# Altium schematic sheet Power supply.SchDoc
size A4; DocumentNumber: 5; SheetNumber: 4; SheetTotal: 5
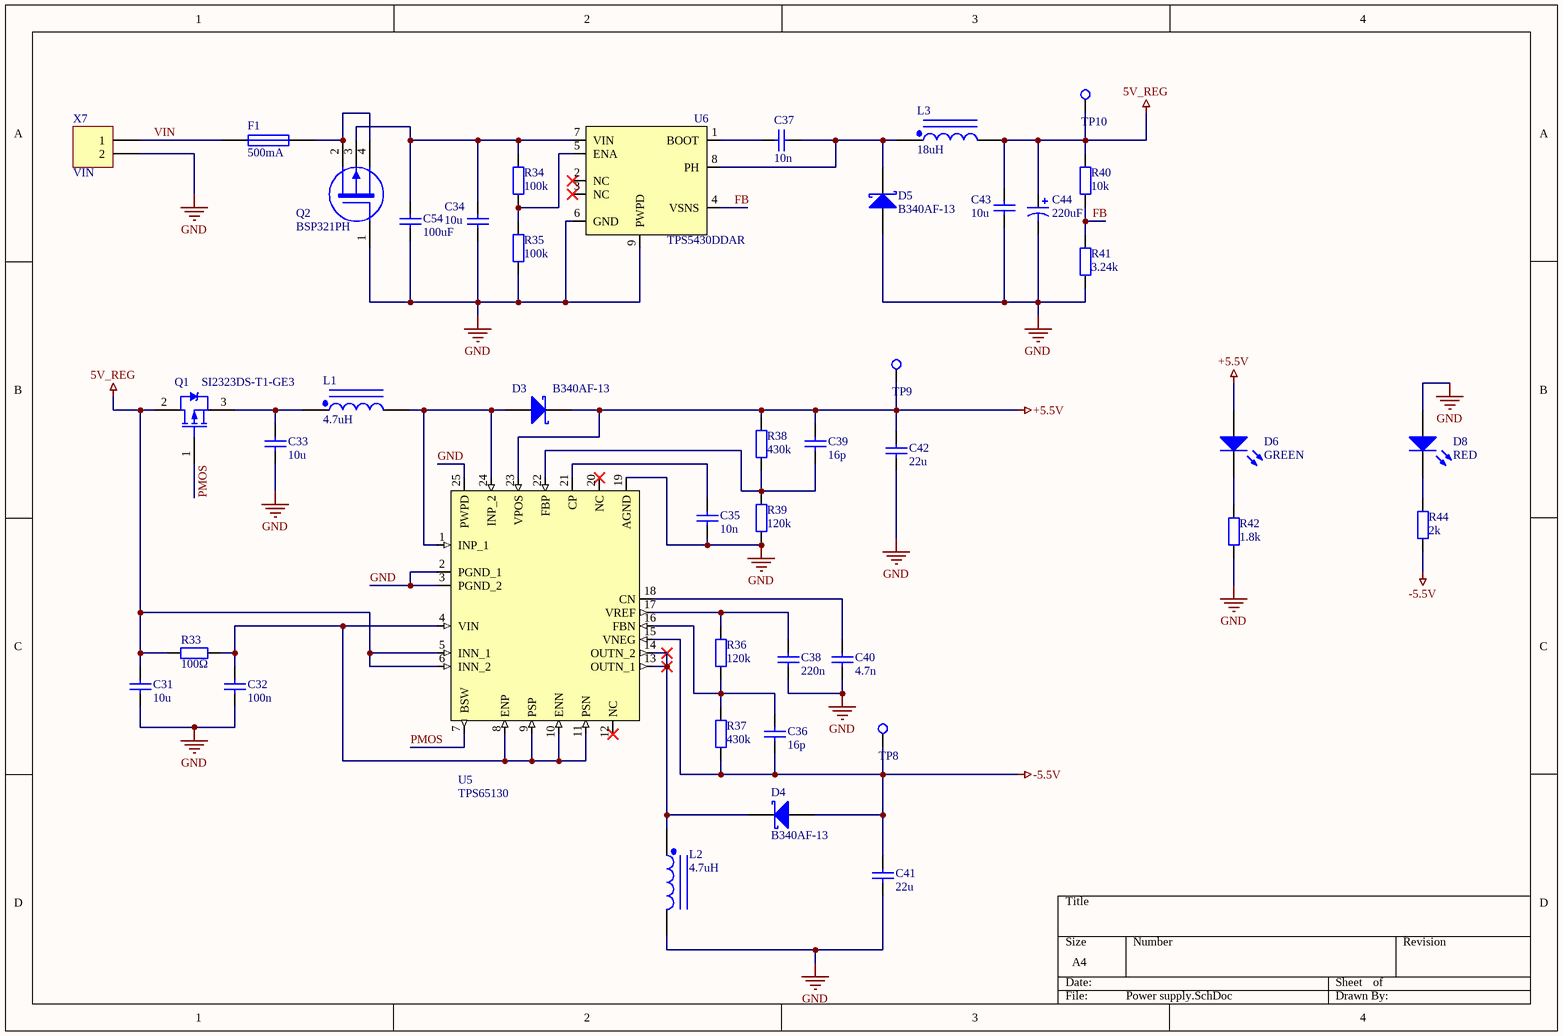
[diagram p0: Power supply.SchDoc]

## Parts
C31  10u  [CAPC2012X110N]
C32  100n  [CAPC1608X87N]
C33  10u  [CAPC2012X110N]
C34  10u  [CAPC2012X110N]
C35  10n  [CAPC1608X87N]
C36  16p  [CAPC1608X87N]
C37  10n  [CAPC1608X87N]
C38  220n  [CAPC1608X87N]
C39  16p  [CAPC1608X87N]
C40  4.7n  [CAPC1608X87N]
C41  22u  [CAPC3225X270N]
C42  22u  [CAPC3225X270N]
C43  10u  [CAPC2012X110N]
C44  220uF  [CAPPM7344X310N]
C54  100uF  [CAPAE1000X1050N]
D3  B340AF-13  [SODFL5226X110N]
D4  B340AF-13  [SODFL5226X110N]
D5  B340AF-13  [SODFL5226X110N]
D6  GREEN  [LEDC2012X110N]
D8  RED  [LEDC2012X110N]
F1  500mA  [RESC1608X55N]
L1  4.7uH  [B82462G4472M]
L2  4.7uH  [B82462G4472M]
L3  18uH  [SRR4828A180M]
Q1  SI2323DS-T1-GE3  [SOT95P237X112-3N]
Q2  BSP321PH  [SOT230P700X170-4N]
R33  100Ω  [RESC1608X55N]
R34  100k  [RESC1608X55N]
R35  100k  [RESC1608X55N]
R36  120k  [RESC1608X55N]
R37  430k  [RESC1608X55N]
R38  430k  [RESC1608X55N]
R39  120k  [RESC1608X55N]
R40  10k  [RESC1608X55N]
R41  3.24k  [RESC1608X55N]
R42  1.8k  [RESC1608X55N]
R44  2k  [RESC1608X55N]
TP8  TP  [TEST-POINT]  (value not drawn)  (no BOM)
TP9  TP  [TEST-POINT]  (value not drawn)  (no BOM)
TP10  TP  [TEST-POINT]  (value not drawn)  (no BOM)
U5  TPS65130  [QFN50P400X400X100-25N-D]
U6  TPS5430DDAR  [SOIC127P600X170-9N]
X7  VIN  [SHDR2W100P0X500_1X2_1120X800X1100P]

## Nets
5V_REG: C31.2 C43.2 C44.1 L3.2 Q1.2(D) R33.1 R40.2 TP10.0 U5.5(INN_1) U5.6(INN_2)
+5.5V: C39.2 C42.2 D3.2(K) D6.1(A) R38.2 TP9.0 U5.23(VPOS)
-5.5V: C36.1 C41.2 D4.1(A) R37.1 R44.1 TP8.0 U5.15(VNEG)
GND: C31.1 C32.1 C33.1 C34.1 C35.1 C38.1 C40.1 C41.1 C42.1 C43.1 C44.2 C54.1 D5.1(A) D8.1(A) L2.2 Q2.1(G) R35.1 R39.1 R41.1 R42.2 U5.2(PGND_1) U5.3(PGND_2) U5.19(AGND) U5.25(PWPD) U6.6(GND) U6.9(PWPD) X7.2
FB: R40.1 R41.2 U6.4(VSNS)
PMOS: Q1.1(G) U5.7(BSW)
VIN: F1.2 X7.1
NetC32_2: C32.2 R33.2 U5.4(VIN) U5.8(ENP) U5.9(PSP) U5.10(ENN) U5.11(PSN)
NetC33_2: C33.2 L1.1 Q1.3(S)
NetC34_2: C34.2 C54.2 Q2.3(U) R34.2 U6.7(VIN)
NetC35_2: C35.2 U5.21(CP)
NetC36_2: C36.2 R36.1 R37.2 U5.16(FBN)
NetC37_1: C37.1 U6.1(BOOT)
NetC37_2: C37.2 D5.2(K) L3.1 U6.8(PH)
NetC38_2: C38.2 R36.2 U5.17(VREF)
NetC39_1: C39.1 R38.1 R39.2 U5.22(FBP)
NetC40_2: C40.2 U5.18(CN)
NetD3_1: D3.1(A) L1.2 U5.1(INP_1) U5.24(INP_2)
NetD4_2: D4.2(K) L2.1 U5.13(OUTN_1) U5.14(OUTN_2)
NetD6_2: D6.2(K) R42.1
NetD8_2: D8.2(K) R44.2
NetF1_1: F1.1 Q2.2(D) Q2.4(S)
NetR34_1: R34.1 R35.2 U6.5(ENA)

Not connected (* = marked no-connect by the designer): U5 12(NC)* 20(NC)*; U6 2(NC)* 3(NC)*

## Library data of the parts
C31 C33 C34 C43 = Cap: Manufacturer 1: Taiyo Yuden; Manufacturer Part Number 1: EMK212BB7106KG-T
C32 = Cap
C35 C37 = Cap: Manufacturer 1: KEMET; Manufacturer Part Number 1: C0603C103J4RACAUTO
C36 C39 = Cap: Manufacturer 1: Taiyo Yuden; Manufacturer Part Number 1: AC0603JRNPO9BN160
C38 = Cap: Manufacturer 1: KEMET; Manufacturer Part Number 1: C0603C224J4RECTU
C40 = Cap: Manufacturer 1: KEMET; Manufacturer Part Number 1: C0603C472J5RACTU
C41 C42 = Cap: Manufacturer 1: Taiyo Yuden; Manufacturer Part Number 1: TMK325B7226MMHP
C44 = Cap Pol1: Manufacturer 1: AVX; Manufacturer Part Number 1: TPSD227M016R0200V
C54 = Cap: Capacitor; Manufacturer 1: Panasonic; Manufacturer Part Number 1: EEE-FC1V101P
D3-D5 = D Schottky: Manufacturer 1: Diodes Incorporated; Manufacturer Part Number 1: B340AF-13
D6 = LED1: Manufacturer 1: Lite-On; Manufacturer Part Number 1: LTST-C170KGKT
D8 = LED1: Manufacturer 1: Lite-On; Manufacturer Part Number 1: LTST-C170CKT
F1 = Fuse 1: Manufacturer 1: Busmann/Eaton; Manufacturer Part Number 1: CC06FA500MA-TR
L1 L2 = Inductor Iron Dot: Manufacturer 1: EPCOS/TDK; Manufacturer Part Number 1: B82462G4472M
L3 = Inductor Iron Dot: Manufacturer 1: Bourns; Manufacturer Part Number 1: SRR4828A-180M
Q1 = PMOS-2: Manufacturer 1: Vishay Semiconductor; Manufacturer Part Number 1: SI2323DS-T1-GE3
Q2 = MOSFET-P4: P-Channel MOSFET, Externally Terminated Substrate; Manufacturer 1: Infineon; Manufacturer Part Number 1: BSP321PH
R33 = Res2: Manufacturer 1: Vishay/Dale; Manufacturer Part Number 1: CRCW0603100RFKEAC
R34 R35 = Res2: Manufacturer 1: Panasonic; Manufacturer Part Number 1: ERJ-3EKF1003V
R36 R39 = Res2: Manufacturer 1: Bourns; Manufacturer Part Number 1: CR0603-FX-1203ELF
R37 R38 = Res2: Manufacturer 1: Bourns; Manufacturer Part Number 1: CR0603-FX-4303ELF
R40 = Res2: Manufacturer 1: Yageo; Manufacturer Part Number 1: RC0603FR-0710KL; MOUSER Part Number: 603-RC0603FR-0710KL
R41 = Res2: Manufacturer 1: Vishay/Dale; Manufacturer Part Number 1: CRCW06033K24FKEA
R42 = Res2: Manufacturer 1: Vishay/Dale; Manufacturer Part Number 1: CRCW060311K8FKEA
R44 = Res2: Manufacturer 1: Vishay/Dale; Manufacturer Part Number 1: CRCW06032K00FKEA
TP8-TP10 = TEST_POINT: Generic test point
U5 = TPS65130: Manufacturer 1: Texas Instruments; Manufacturer Part Number 1: TPS65130RGER
U6 = TPS5430: Manufacturer 1: Texas Instruments; Manufacturer Part Number 1: TPS5430DDAR
X7 = Header 2: Manufacturer 1: Wurth Elektronik; Manufacturer Part Number 1: 691111710002